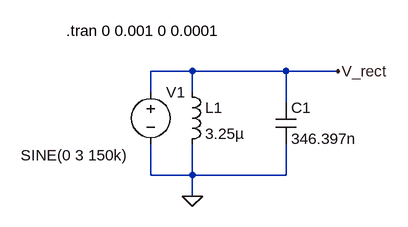
[diagram p0: schematic Main_Project.asc]
Main_Project.asc, the LTspice schematic file:
Version 4
SHEET 1 880 680
WIRE -48 -64 -112 -64
WIRE 96 -64 -48 -64
WIRE 176 -64 96 -64
WIRE -112 -32 -112 -64
WIRE -48 -32 -48 -64
WIRE 96 -16 96 -64
WIRE -112 96 -112 48
WIRE -48 96 -48 48
WIRE -48 96 -112 96
WIRE 96 96 96 48
WIRE 96 96 -48 96
WIRE -48 128 -48 96
FLAG -48 128 0
FLAG 176 -64 V_rect
SYMBOL ind -64 -48 R0
SYMATTR InstName L1
SYMATTR Value 3.25µ
SYMBOL cap 80 -16 R0
SYMATTR InstName C1
SYMATTR Value 346.397n
SYMBOL voltage -112 -48 R0
WINDOW 3 -200 113 Left 2
WINDOW 123 0 0 Left 0
WINDOW 39 0 0 Left 0
SYMATTR InstName V1
SYMATTR Value SINE(0 3 150k)
TEXT -242 -126 Left 2 !.tran 0 0.001 0 0.0001

The netlist it stands for:
* Main_Project.asc
L1 V_rect 0 3.25µ
C1 V_rect 0 346.397n
V1 V_rect 0 SINE(0 3 150k)
.tran 0 0.001 0 0.0001
.backanno
.end